# Altium schematic sheet esp_part.SchDoc
size A3; SheetNumber: 1; SheetTotal: 3; SPICEModelCacheOSMDEVOJ: <root> / <DocumentId>OSMDEVOJ</DocumentId> / </root>
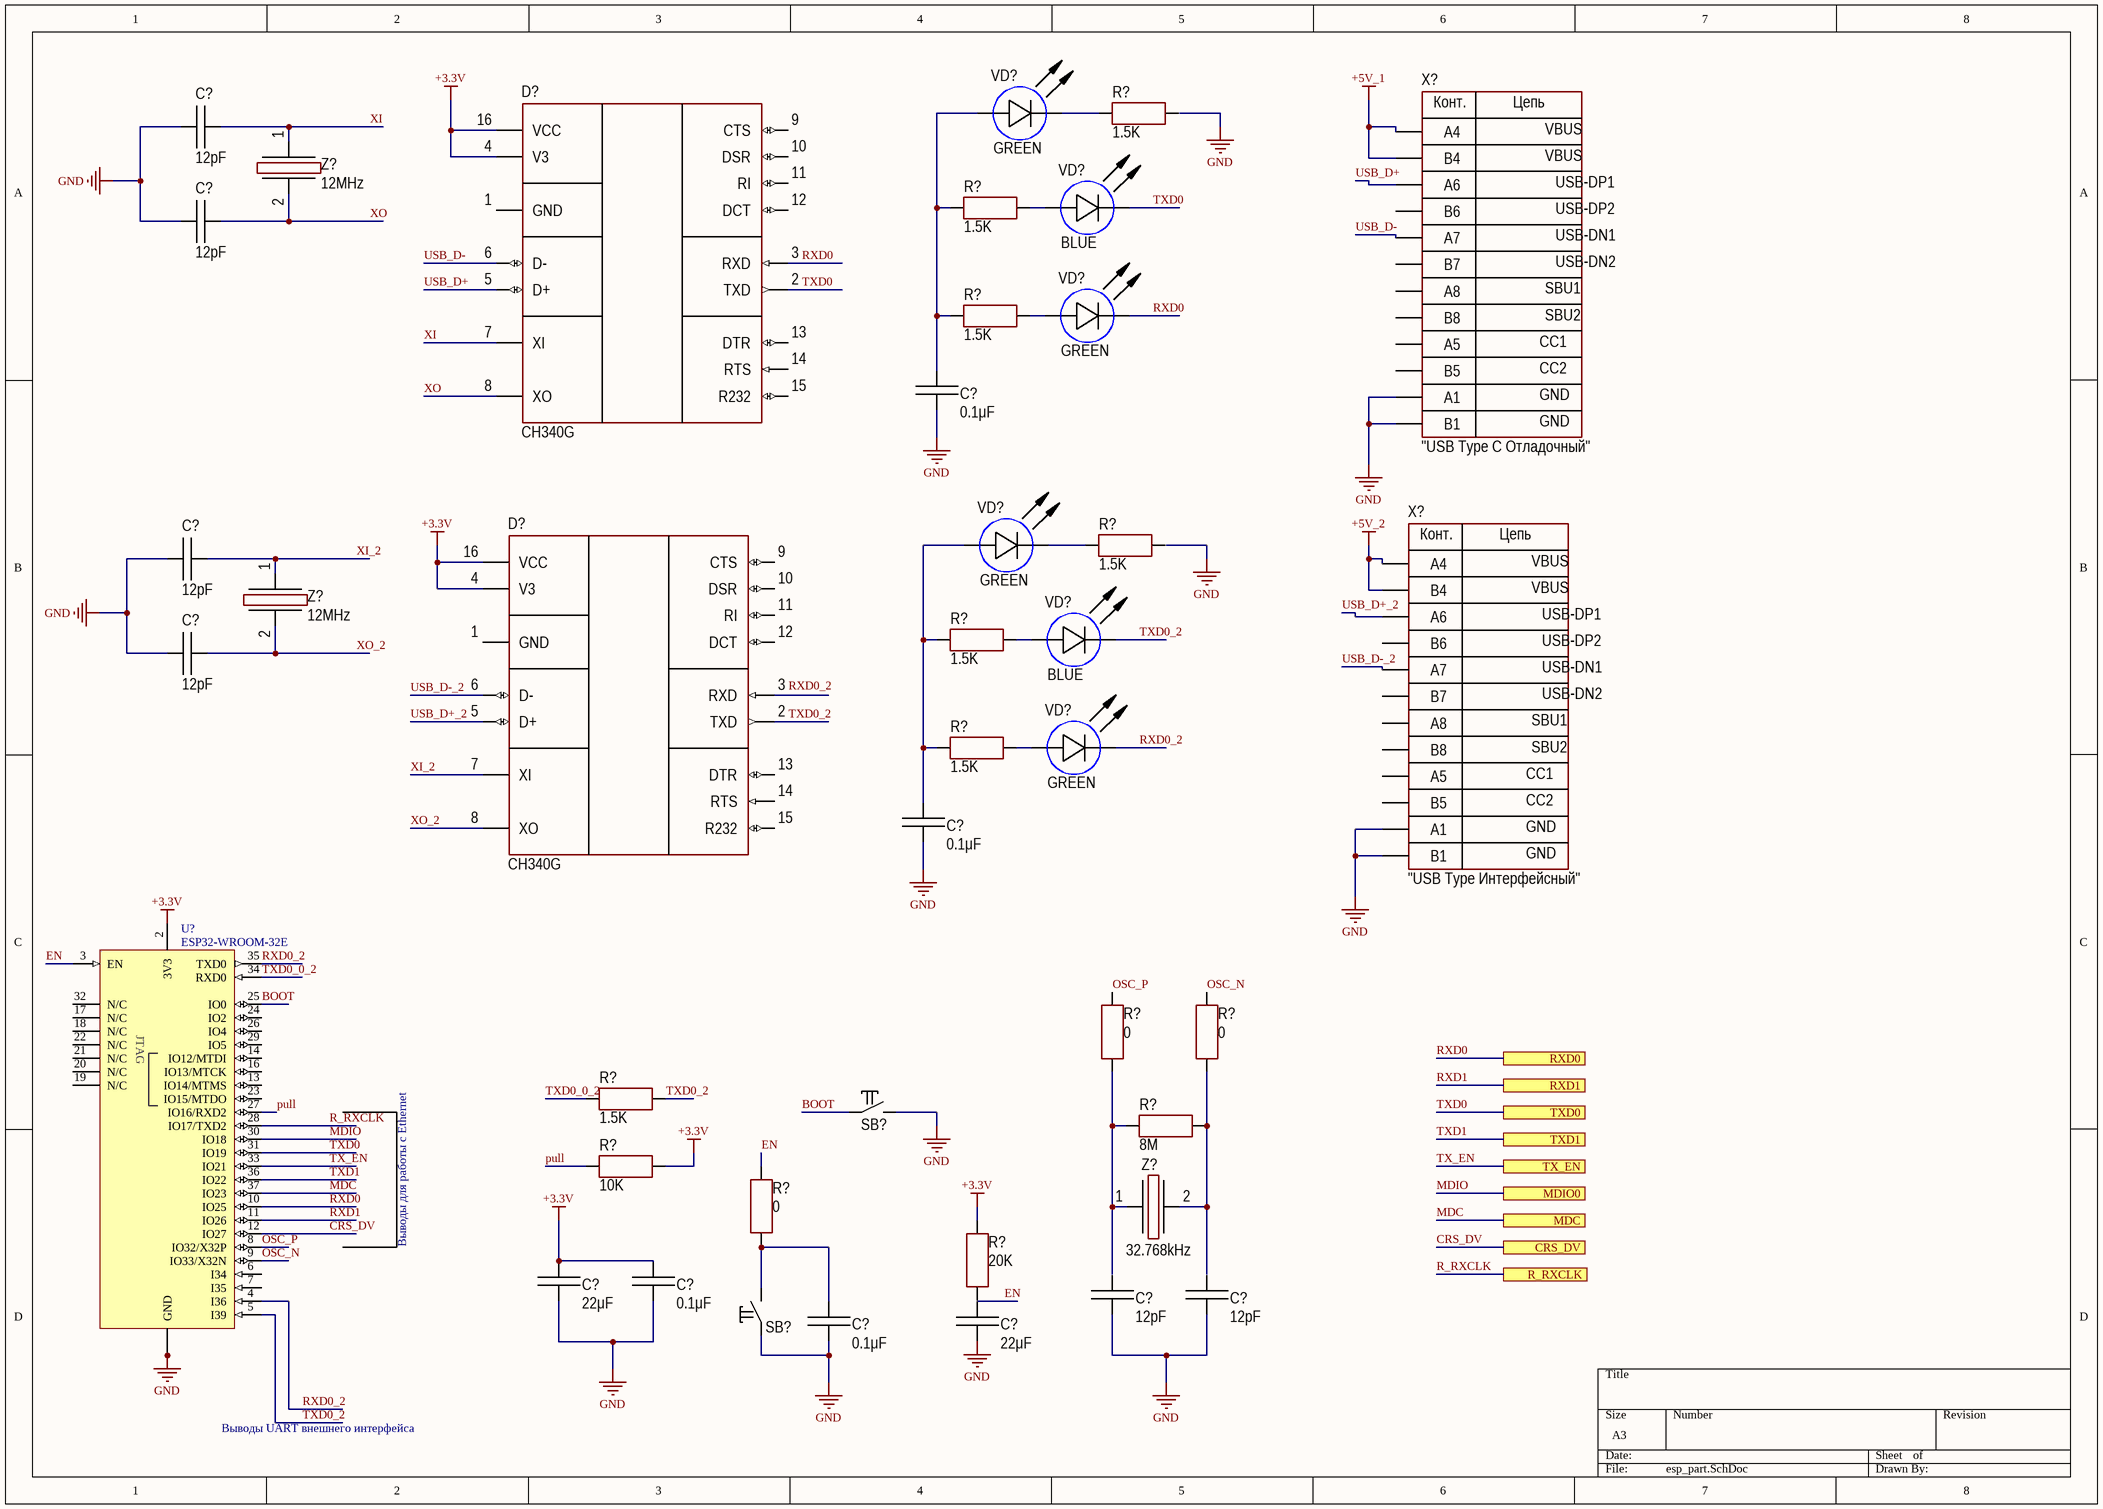
[diagram p0: esp_part.SchDoc]

## Parts
(Parts that share a designator on the sheet are numbered #1, #2 ... from top to bottom, then left to right.)
C?#1  value 12pF  [CAP: 0603]
C?#2  value 12pF  [CAP: 0603]
C?#3  value 0.1μF  [CAP: 0603]
C?#4  value 12pF  [CAP: 0603]
C?#5  value 12pF  [CAP: 0603]
C?#6  value 0.1μF  [CAP: 0603]
C?#7  value 22μF  [CAP: 0603]
C?#8  value 0.1μF  [CAP: 0603]
C?#9  value 12pF  [CAP: 0603]
C?#10  value 12pF  [CAP: 0603]
C?#11  value 0.1μF  [CAP: 0603]
C?#12  value 22μF  [CAP: 0603]
D?#1  (no value)  [16-SOP]
D?#2  (no value)  [16-SOP]
R?#1  value 1.5K  [RES: 0603]
R?#2  value 1.5K  [RES: 0603]
R?#3  value 1.5K  [RES: 0603]
R?#4  value 1.5K  [RES: 0603]
R?#5  value 1.5K  [RES: 0603]
R?#6  value 1.5K  [RES: 0603]
R?#7  value 0  [RES: 0603]
R?#8  value 0  [RES: 0603]
R?#9  value 1.5K  [RES: 0603]
R?#10  value 8M  [RES: 0603]
R?#11  value 10K  [RES: 0603]
R?#12  value 0  [RES: 0603]
R?#13  value 20K  [RES: 0603]
SB?#1  (no value)  [BUT: 6x3.5 TH]
SB?#2  (no value)  [BUT: 6x3.5 TH]
U?  ESP32-WROOM-32E  [ESP32-WROOM-32E]
VD?#1  Color: GREEN  [LED: 0402B]
VD?#2  Color: BLUE  [LED: 0402B]
VD?#3  Color: GREEN  [LED: 0402B]
VD?#4  Color: GREEN  [LED: 0402B]
VD?#5  Color: BLUE  [LED: 0402B]
VD?#6  Color: GREEN  [LED: 0402B]
X?#1  CommentText: "USB Type C Отладочный"  [CON: TYPE-C-31-M-12]
X?#2  CommentText: "USB Type Интерфейсный"  [CON: TYPE-C-31-M-12]
Z?#1  Frequency: 12MHz  [OSC: 3215]
Z?#2  Frequency: 12MHz  [OSC: 3215]
Z?#3  Frequency: 32.768kHz  [OSC: 3215]

## Ports
CRS_DV (see Ethernet_part[4B]), MDC (see Ethernet_part[4B]), MDIO0 (see Ethernet_part[4A]), R_RXCLK (see Ethernet_part[4B]), RXD0 (see Ethernet_part[4A]), RXD1 (see Ethernet_part[4A]), TX_EN (see Ethernet_part[4A]), TXD0 (see Ethernet_part[4A]), TXD1 (see Ethernet_part[4A])

## Nets
+3.3V: C?#7.2 C?#8.2 D?#1.4(V3) D?#1.16(VCC) D?#2.4(V3) D?#2.16(VCC) R?#11.1 R?#13.2 U?.2(3V3)
+5V_1: X?#1.A4 X?#1.B4
+5V_2: X?#2.A4 X?#2.B4
GND: C?#1.1 C?#2.1 C?#3.1 C?#4.1 C?#5.1 C?#6.1 C?#7.1 C?#8.1 C?#9.1 C?#10.1 C?#11.2 C?#12.2 SB?#1.2 SB?#2.1 U?.1(GND) U?.15(GND) U?.38(GND) U?.39(GND) X?#1.A1 X?#1.B1 X?#2.A1 X?#2.B1
BOOT: SB?#1.1 U?.25(IO0)
CRS_DV: U?.12(IO27) ; port CRS_DV
EN: C?#12.1 R?#12.2 U?.3(EN)
MDC: U?.37(IO23) ; port MDC
MDIO: U?.30(IO18) ; port MDIO0
OSC_N: R?#8.1 U?.9(IO33/X32N)
OSC_P: R?#7.1 U?.8(IO32/X32P)
pull: R?#11.2 U?.27(IO16/RXD2)
R_RXCLK: U?.28(IO17/TXD2) ; port R_RXCLK
RXD0: D?#1.3(RXD) U?.10(IO25) VD?#3.2(C) ; port RXD0
RXD0_2: U?.4(I36) U?.35(TXD0) VD?#6.2(C)
RXD1: U?.11(IO26) ; port RXD1
TX_EN: U?.33(IO21) ; port TX_EN
TXD0: D?#1.2(TXD) U?.31(IO19) VD?#2.2(C) ; port TXD0
TXD0_0_2: R?#9.2 U?.34(RXD0)
TXD0_2: D?#2.2(TXD) R?#9.1 U?.5(I39) VD?#5.2(C)
TXD1: U?.36(IO22) ; port TXD1
USB_D+: D?#1.5(D+) X?#1.A6
USB_D+_2: D?#2.5(D+) X?#2.A6
USB_D-: D?#1.6(D-) X?#1.A7
USB_D-_2: D?#2.6(D-) X?#2.A7
XI: D?#1.7(XI) Z?#1.1
XI_2: D?#2.7(XI) Z?#2.1
XO: D?#1.8(XO) Z?#1.2
XO_2: D?#2.8(XO) Z?#2.2
NetC?#3_2: C?#3.2 R?#2.2 R?#3.2 VD?#1.1(A)
NetC?#6_2: C?#6.2 R?#5.2 R?#6.2 VD?#4.1(A)
NetC?#11_1: C?#11.1 R?#12.1 SB?#2.2
NetR?#1_2: R?#1.2 VD?#1.2(C)
NetR?#2_1: R?#2.1 VD?#2.1(A)
NetR?#3_1: R?#3.1 VD?#3.1(A)
NetR?#4_2: R?#4.2 VD?#4.2(C)
NetR?#5_1: R?#5.1 VD?#5.1(A)
NetR?#6_1: R?#6.1 VD?#6.1(A)
NetR?#7_2: R?#7.2 R?#10.2 Z?#3.1
NetR?#8_2: R?#8.2 R?#10.1 Z?#3.2

Not connected (* = marked no-connect by the designer): C?#1 2; C?#2 2; C?#4 2; C?#5 2; C?#9 2; C?#10 2; D?#1 1(GND) 9(CTS) 10(DSR) 11(RI) 12(DCT) 13(DTR) 14(RTS) 15(R232); D?#2 1(GND) 3(RXD) 9(CTS) 10(DSR) 11(RI) 12(DCT) 13(DTR) 14(RTS) 15(R232); R?#1 1; R?#4 1; R?#13 1; U? 6(I34) 7(I35) 13(IO14/MTMS) 14(IO12/MTDI) 16(IO13/MTCK) 17(N/C) 18(N/C) 19(N/C) 20(N/C) 21(N/C) 22(N/C) 23(IO15/MTDO) 24(IO2) 26(IO4) 29(IO5) 32(N/C); X?#1 A5 A8 B5 B6 B7 B8; X?#2 A5 A8 B5 B6 B7 B8

## Notes on the sheet
- Выводы для работы с Ethernet
- Выводы UART внешнего интерфейса
- Labels drawn without touching a wire or pin: RXD0_2
- (in symbol Connector_USB_Type_C) Конт.; Цепь; VBUS; USB-DP1; USB-DP2; USB-DN1; USB-DN2; SBU1; SBU2; CC1; CC2; GND
- (in symbol ESP32-WROOM-32E) JTAG

## Library data of the parts
C?#1 C?#2 C?#4 C?#5 C?#9 C?#10 = Ceramic_0603: Manufacturer: Yageo; PartNumber: CC0603KRX7R7BB104; ValueManufacturerPartNumber: Ceramic capacitor, 12pF, X7R, ±10%, 16V, 0603, -55...+125°C; TypeCapacitor: Ceramic capacitor; Tolerance: ±10%; TypeDielectric: X7R; Voltage: 16V; Package: 0603; HelpURL: https://www.digikey.com/product-detail/en/yageo/CC0603KRX7R7BB104/311-1088-1-ND/302998; Temperature: -55...+125°C
C?#3 C?#6 C?#8 C?#11 = Ceramic_0603: Manufacturer: Yageo; PartNumber: CC0603KRX7R7BB104; ValueManufacturerPartNumber: Ceramic capacitor, 0.1μF, X7R, ±10%, 16V, 0603, -55...+125°C; TypeCapacitor: Ceramic capacitor; Tolerance: ±10%; TypeDielectric: X7R; Voltage: 16V; Package: 0603; HelpURL: https://www.digikey.com/product-detail/en/yageo/CC0603KRX7R7BB104/311-1088-1-ND/302998; Temperature: -55...+125°C
C?#7 C?#12 = Ceramic_0603: Manufacturer: Yageo; PartNumber: CC0603KRX7R7BB104; ValueManufacturerPartNumber: Ceramic capacitor, 22μF, X7R, ±10%, 16V, 0603, -55...+125°C; TypeCapacitor: Ceramic capacitor; Tolerance: ±10%; TypeDielectric: X7R; Voltage: 16V; Package: 0603; HelpURL: https://www.digikey.com/product-detail/en/yageo/CC0603KRX7R7BB104/311-1088-1-ND/302998; Temperature: -55...+125°C
D?#1 D?#2 = CH340G: USB-to-UART; Manufacturer: WCH(Jiangsu Qin Heng); ValueManufacturerPartNumber: IC usb-to-uart bridge, USB2.0, 3...3.6V, -40...+85°C, 16- SOP; Supply: 3...3.6V; HelpURL: https://lcsc.com/product-detail/USB-ICs_WCH-Jiangsu-Qin-Heng-CH340G_C14267.html; Package: 16- SOP; ComponentType: IC usb-to-uart bridge; Temperature: -40...+85°C; Standard: USB2.0; PartNumber: CH340G
R?#1-R?#6 R?#9 = Resistor_0603: Manufacturer: Yageo; PartNumber: RC0603JR-07100RL; ValueManufacturerPartNumber: Resistor film, 1.5K, ±5%, 0603, 0.1W, -55...+125°C; TypeResistor: Resistor film; Power: 0.1W; Tolerance: ±5%; Package: 0603; HelpURL: https://www.digikey.com/product-detail/en/yageo/RC0603JR-07100RL/311-100GRCT-ND/729644; Temperature: -55...+125°C
R?#7 R?#8 R?#12 = Resistor_0603: Manufacturer: Yageo; PartNumber: RC0603JR-07100RL; ValueManufacturerPartNumber: Resistor film, 0, ±5%, 0603, 0.1W, -55...+125°C; TypeResistor: Resistor film; Power: 0.1W; Tolerance: ±5%; Package: 0603; HelpURL: https://www.digikey.com/product-detail/en/yageo/RC0603JR-07100RL/311-100GRCT-ND/729644; Temperature: -55...+125°C
R?#10 = Resistor_0603: Manufacturer: Yageo; PartNumber: RC0603JR-07100RL; ValueManufacturerPartNumber: Resistor film, 8M, ±5%, 0603, 0.1W, -55...+125°C; TypeResistor: Resistor film; Power: 0.1W; Tolerance: ±5%; Package: 0603; HelpURL: https://www.digikey.com/product-detail/en/yageo/RC0603JR-07100RL/311-100GRCT-ND/729644; Temperature: -55...+125°C
R?#11 = Resistor_0603: Manufacturer: Yageo; PartNumber: RC0603JR-07100RL; ValueManufacturerPartNumber: Resistor film, 10K, ±5%, 0603, 0.1W, -55...+125°C; TypeResistor: Resistor film; Power: 0.1W; Tolerance: ±5%; Package: 0603; HelpURL: https://www.digikey.com/product-detail/en/yageo/RC0603JR-07100RL/311-100GRCT-ND/729644; Temperature: -55...+125°C
R?#13 = Resistor_0603: Manufacturer: Yageo; PartNumber: RC0603JR-07100RL; ValueManufacturerPartNumber: Resistor film, 20K, ±5%, 0603, 0.1W, -55...+125°C; TypeResistor: Resistor film; Power: 0.1W; Tolerance: ±5%; Package: 0603; HelpURL: https://www.digikey.com/product-detail/en/yageo/RC0603JR-07100RL/311-100GRCT-ND/729644; Temperature: -55...+125°C
SB?#1 SB?#2 = Button_tactile: Manufacturer: TE Connectivity; ValueManufacturerPartNumber: Tactile button, 6x6mm; PartNumber: FSM2JSMAATR; TypeButton: Tactile button; CommentText: "Кнопка"; HelpURL: https://www.digikey.com/product-detail/en/te-connectivity-alcoswitch-switches/FSM2JSMAATR/450-1792-1-ND/3503931; Package: 6x6mm
U? = ESP32-WROOM-32E: PCB Antenna - 4,8,16 MB Flash - WiFi - BT - MCU; Manufacturer_Name: Espressif Systems; ComponentLink1Description: Datasheet; ComponentLink1URL: https://www.espressif.com/sites/default/files/documentation/esp32-wroom-32e_esp32-wroom-32ue_datasheet_en.pdf; ComponentLink2Description: SoC Datasheet; ComponentLink2URL: https://www.espressif.com/sites/default/files/documentation/esp32_datasheet_en.pdf; ComponentLink3Description: Devkit; ComponentLink3URL: https://www.espressif.com/en/products/devkits/esp32-devkitc
VD?#1 VD?#3 VD?#4 VD?#6 = LED_single: ValueManufacturerPartNumber: LED, Green, *, *, *, -55...+150°C; TypeDiode: LED; Manufacturer: *; Package: *; HelpURL: *; Temperature: -55...+150°C; Current: *; VoltageDrop: *; PartNumber: *; ColorParameter: Green
VD?#2 VD?#5 = LED_single: ValueManufacturerPartNumber: LED, Green, *, *, *, -55...+150°C; TypeDiode: LED; ColorParameter: Green; Manufacturer: *; Package: *; HelpURL: *; Temperature: -55...+150°C; Current: *; VoltageDrop: *; PartNumber: *
X?#1 X?#2 = Connector_USB_Type_C: Manufacturer: Korean Hroparts; ValueManufacturerPartNumber: USB Type C, 3A; PartNumber: TYPE-C-31-M-12; TypeConnector: USB Type C; CurrentMax: 3A; HelpURL: https://lcsc.com/product-detail/USB-Type-C_Korean-Hroparts-Elec-TYPE-C-31-M-12_C165948.html
Z?#1 Z?#2 = Crystal_3215: Manufacturer: Epson; PartNumber: FC-135 32.7680KA-A5; ValueManufacturerPartNumber: Crystal, 12MHz, 12.5pF, ±20ppm, case 3215, -40...+85°C; LoadCapacitance: 12.5pF; Tolerance: ±20ppm; Package: case 3215; HelpURL: https://www.digikey.com/product-detail/en/epson/FC-135-32.7680KA-A5/SER4103CT-ND/6188447; Temperature: -40...+85°C; TypeOscilator: Crystal
Z?#3 = Crystal_3215: Manufacturer: Epson; PartNumber: FC-135 32.7680KA-A5; ValueManufacturerPartNumber: Crystal, 32.768kHz, 12.5pF, ±20ppm, case 3215, -40...+85°C; LoadCapacitance: 12.5pF; Tolerance: ±20ppm; Package: case 3215; HelpURL: https://www.digikey.com/product-detail/en/epson/FC-135-32.7680KA-A5/SER4103CT-ND/6188447; Temperature: -40...+85°C; TypeOscilator: Crystal